# EAGLE design unihat-v1 (EAGLE 7.7.0)
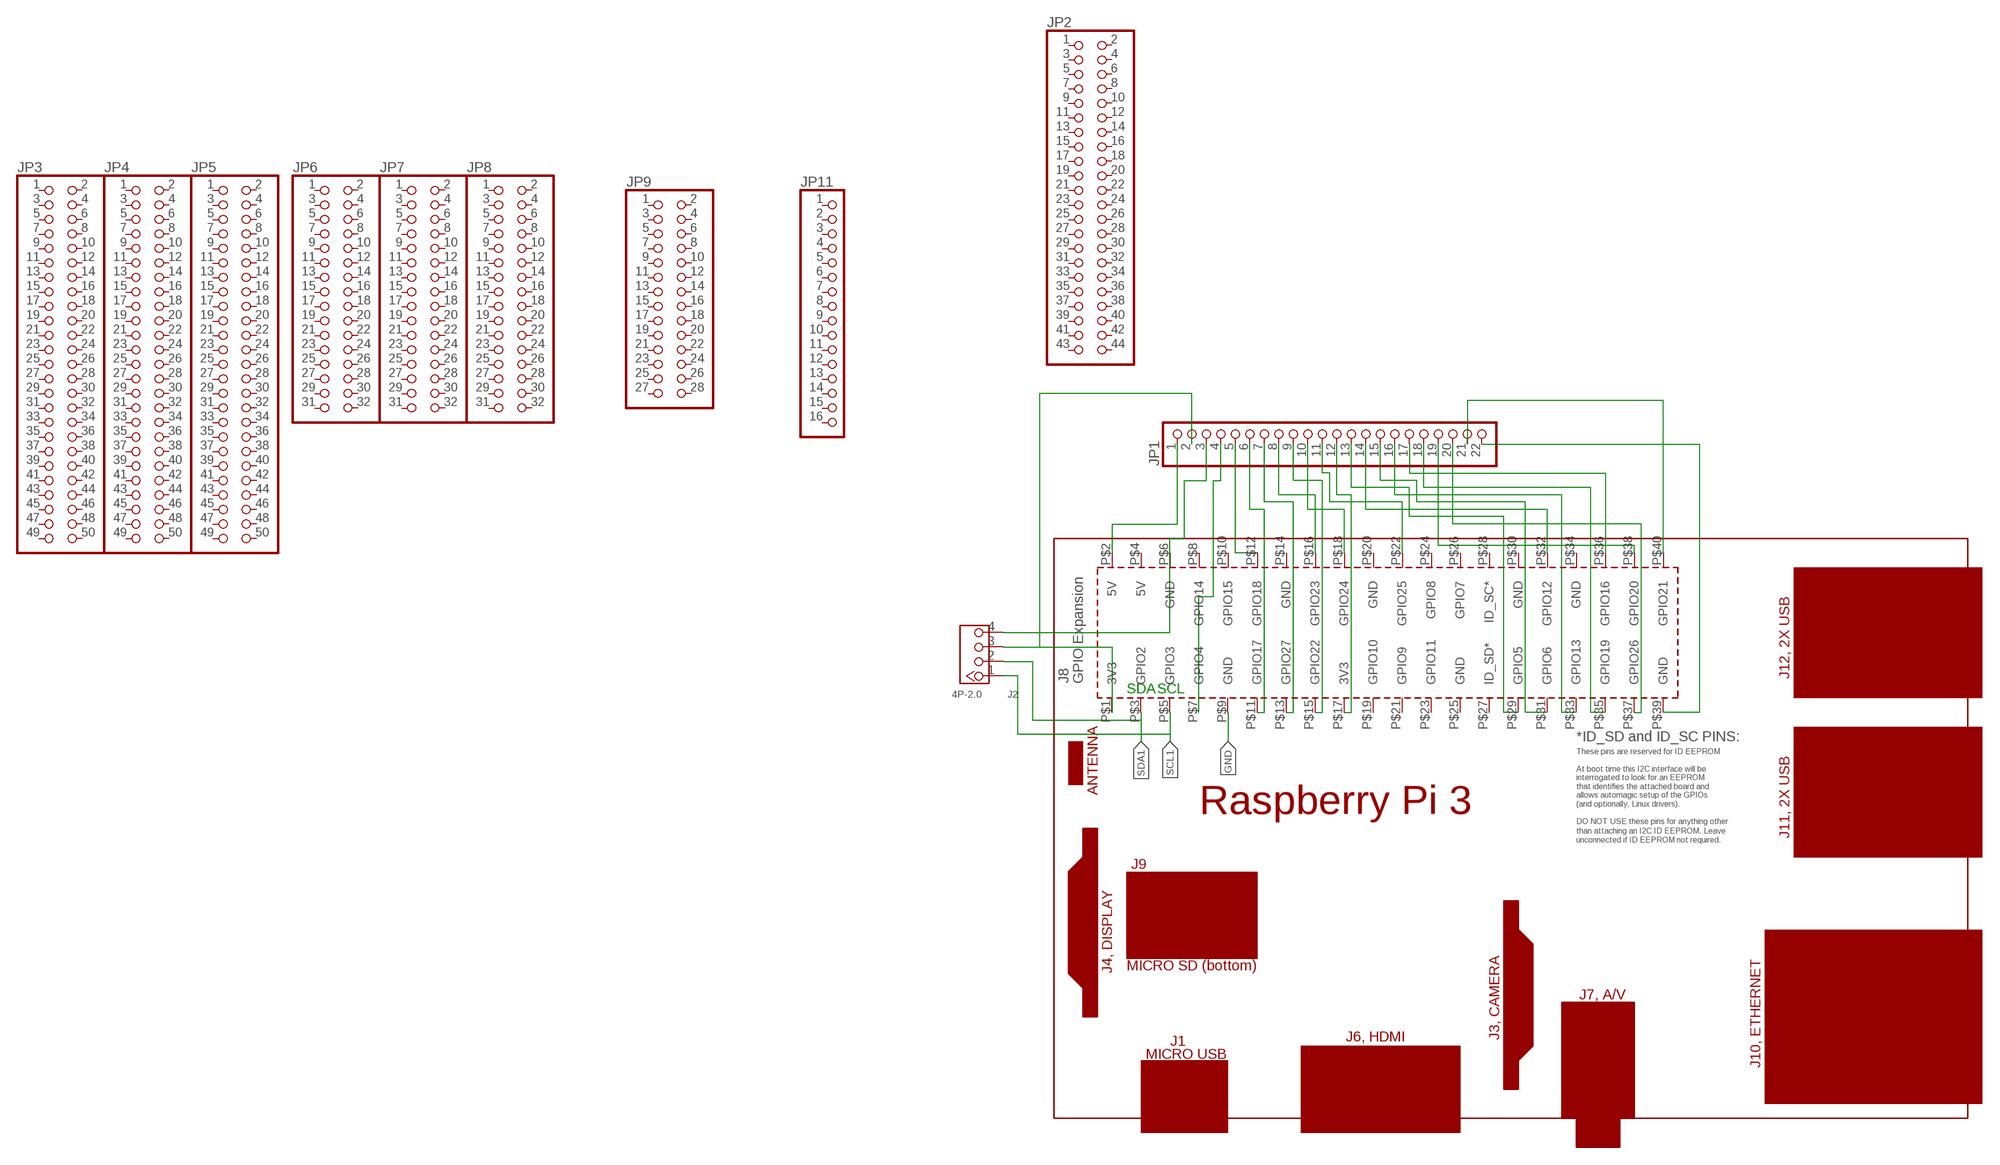
[diagram p0: schematic, sheet 1]

## Parts
J2  4P-2.0  GROVE-CONNECTOR-DIP(4P-2.0)  [HW4-2.0]
JP1  PINHD-1X22  [1X22]
JP2  PINHD-2X22  [2X22]
JP3  PINHD-2X25  [2X25]
JP4  PINHD-2X25  [2X25]
JP5  PINHD-2X25  [2X25]
JP6  PINHD-2X16  [2X16]
JP7  PINHD-2X16  [2X16]
JP8  PINHD-2X16  [2X16]
JP9  PINHD-2X14  [2X14]
JP11  PINHD-1X16  [1X16]
PCB1  RPI3  [RPI3]

## Nets
GND: PCB1.P$9(GND)
N$1: JP1.5 PCB1.P$12(GPIO18)
N$2: JP1.1 PCB1.P$2(5V)
N$3: J2.3 JP1.2 PCB1.P$1(3V3)
N$4: J2.4 JP1.3 PCB1.P$6(GND)
N$5: JP1.4 PCB1.P$7(GPIO4)
N$6: JP1.6 PCB1.P$11(GPIO17)
N$7: JP1.7 PCB1.P$13(GPIO27)
N$8: JP1.8 PCB1.P$16(GPIO23)
N$9: JP1.9 PCB1.P$15(GPIO22)
N$10: JP1.10 PCB1.P$18(GPIO24)
N$11: JP1.11 PCB1.P$22(GPIO25)
N$12: JP1.13 PCB1.P$29(GPIO5)
N$13: JP1.12 PCB1.P$17(3V3)
N$14: JP1.14 PCB1.P$32(GPIO12)
N$15: JP1.15 PCB1.P$31(GPIO6)
N$16: JP1.16 PCB1.P$33(GPIO13)
N$17: JP1.17 PCB1.P$36(GPIO16)
N$18: JP1.18 PCB1.P$35(GPIO19)
N$19: JP1.19 PCB1.P$38(GPIO20)
N$20: JP1.20 PCB1.P$37(GPIO26)
N$21: JP1.21 PCB1.P$40(GPIO21)
N$22: JP1.22 PCB1.P$39(GND)
SCL1: J2.1 PCB1.P$5(GPIO3)
SDA1: J2.2 PCB1.P$3(GPIO2)
Unconnected: JP2.1 JP2.2 JP2.3 JP2.4 JP2.5 JP2.6 JP2.7 JP2.8 JP2.9 JP2.10 JP2.11 JP2.12 JP2.13 JP2.14 JP2.15 JP2.16 JP2.17 JP2.18 JP2.19 JP2.20 JP2.21 JP2.22 JP2.23 JP2.24 JP2.25 JP2.26 JP2.27 JP2.28 JP2.29 JP2.30 JP2.31 JP2.32 JP2.33 JP2.34 JP2.35 JP2.36 JP2.37 JP2.38 JP2.39 JP2.40 JP2.41 JP2.42 JP2.43 JP2.44 JP3.1 JP3.2 JP3.3 JP3.4 JP3.5 JP3.6 JP3.7 JP3.8 JP3.9 JP3.10 JP3.11 JP3.12 JP3.13 JP3.14 JP3.15 JP3.16 JP3.17 JP3.18 JP3.19 JP3.20 JP3.21 JP3.22 JP3.23 JP3.24 JP3.25 JP3.26 JP3.27 JP3.28 JP3.29 JP3.30 JP3.31 JP3.32 JP3.33 JP3.34 JP3.35 JP3.36 JP3.37 JP3.38 JP3.39 JP3.40 JP3.41 JP3.42 JP3.43 JP3.44 JP3.45 JP3.46 JP3.47 JP3.48 JP3.49 JP3.50 JP4.1 JP4.2 JP4.3 JP4.4 JP4.5 JP4.6 JP4.7 JP4.8 JP4.9 JP4.10 JP4.11 JP4.12 JP4.13 JP4.14 JP4.15 JP4.16 JP4.17 JP4.18 JP4.19 JP4.20 JP4.21 JP4.22 JP4.23 JP4.24 JP4.25 JP4.26 JP4.27 JP4.28 JP4.29 JP4.30 JP4.31 JP4.32 JP4.33 JP4.34 JP4.35 JP4.36 JP4.37 JP4.38 JP4.39 JP4.40 JP4.41 JP4.42 JP4.43 JP4.44 JP4.45 JP4.46 JP4.47 JP4.48 JP4.49 JP4.50 JP5.1 JP5.2 JP5.3 JP5.4 JP5.5 JP5.6 JP5.7 JP5.8 JP5.9 JP5.10 JP5.11 JP5.12 JP5.13 JP5.14 JP5.15 JP5.16 JP5.17 JP5.18 JP5.19 JP5.20 JP5.21 JP5.22 JP5.23 JP5.24 JP5.25 JP5.26 JP5.27 JP5.28 JP5.29 JP5.30 JP5.31 JP5.32 JP5.33 JP5.34 JP5.35 JP5.36 JP5.37 JP5.38 JP5.39 JP5.40 JP5.41 JP5.42 JP5.43 JP5.44 JP5.45 JP5.46 JP5.47 JP5.48 JP5.49 JP5.50 JP6.1 JP6.2 JP6.3 JP6.4 JP6.5 JP6.6 JP6.7 JP6.8 JP6.9 JP6.10 JP6.11 JP6.12 JP6.13 JP6.14 JP6.15 JP6.16 JP6.17 JP6.18 JP6.19 JP6.20 JP6.21 JP6.22 JP6.23 JP6.24 JP6.25 JP6.26 JP6.27 JP6.28 JP6.29 JP6.30 JP6.31 JP6.32 JP7.1 JP7.2 JP7.3 JP7.4 JP7.5 JP7.6 JP7.7 JP7.8 JP7.9 JP7.10 JP7.11 JP7.12 JP7.13 JP7.14 JP7.15 JP7.16 JP7.17 JP7.18 JP7.19 JP7.20 JP7.21 JP7.22 JP7.23 JP7.24 JP7.25 JP7.26 JP7.27 JP7.28 JP7.29 JP7.30 JP7.31 JP7.32 JP8.1 JP8.2 JP8.3 JP8.4 JP8.5 JP8.6 JP8.7 JP8.8 JP8.9 JP8.10 JP8.11 JP8.12 JP8.13 JP8.14 JP8.15 JP8.16 JP8.17 JP8.18 JP8.19 JP8.20 JP8.21 JP8.22 JP8.23 JP8.24 JP8.25 JP8.26 JP8.27 JP8.28 JP8.29 JP8.30 JP8.31 JP8.32 JP9.1 JP9.2 JP9.3 JP9.4 JP9.5 JP9.6 JP9.7 JP9.8 JP9.9 JP9.10 JP9.11 JP9.12 JP9.13 JP9.14 JP9.15 JP9.16 JP9.17 JP9.18 JP9.19 JP9.20 JP9.21 JP9.22 JP9.23 JP9.24 JP9.25 JP9.26 JP9.27 JP9.28 JP11.1 JP11.2 JP11.3 JP11.4 JP11.5 JP11.6 JP11.7 JP11.8 JP11.9 JP11.10 JP11.11 JP11.12 JP11.13 JP11.14 JP11.15 JP11.16 PCB1.P$4(5V) PCB1.P$8(GPIO14) PCB1.P$10(GPIO15) PCB1.P$14(GND) PCB1.P$19(GPIO10) PCB1.P$20(GND) PCB1.P$21(GPIO9) PCB1.P$23(GPIO11) PCB1.P$24(GPIO8) PCB1.P$25(GND) PCB1.P$26(GPIO7) PCB1.P$27(ID_SD*) PCB1.P$28(ID_SC*) PCB1.P$30(GND) PCB1.P$34(GND)

## Notes on the sheet
- SDA | SCL

## Library data of the parts
J2 = Seeed-OPL-Connector:GROVE-CONNECTOR-DIP(4P-2.0): 320110033
JP1 = 0my2:PINHD-1X22: PIN HEADER
JP2 = 0my2:PINHD-2X22: PIN HEADER
JP3-JP5 = 0my2:PINHD-2X25: PIN HEADER
JP6-JP8 = 0my2:PINHD-2X16: PIN HEADER
JP9 = 0my2:PINHD-2X14: PIN HEADER
JP11 = 0my2:PINHD-1X16: PIN HEADER
PCB1 = 0_Rpi3_RevA:RPI3: Device for Raspberry Pi 3 board created by Dave Young for www.element14.com More information and support community is available at https://www.element14.com/community/community/raspberry-pi

## Board
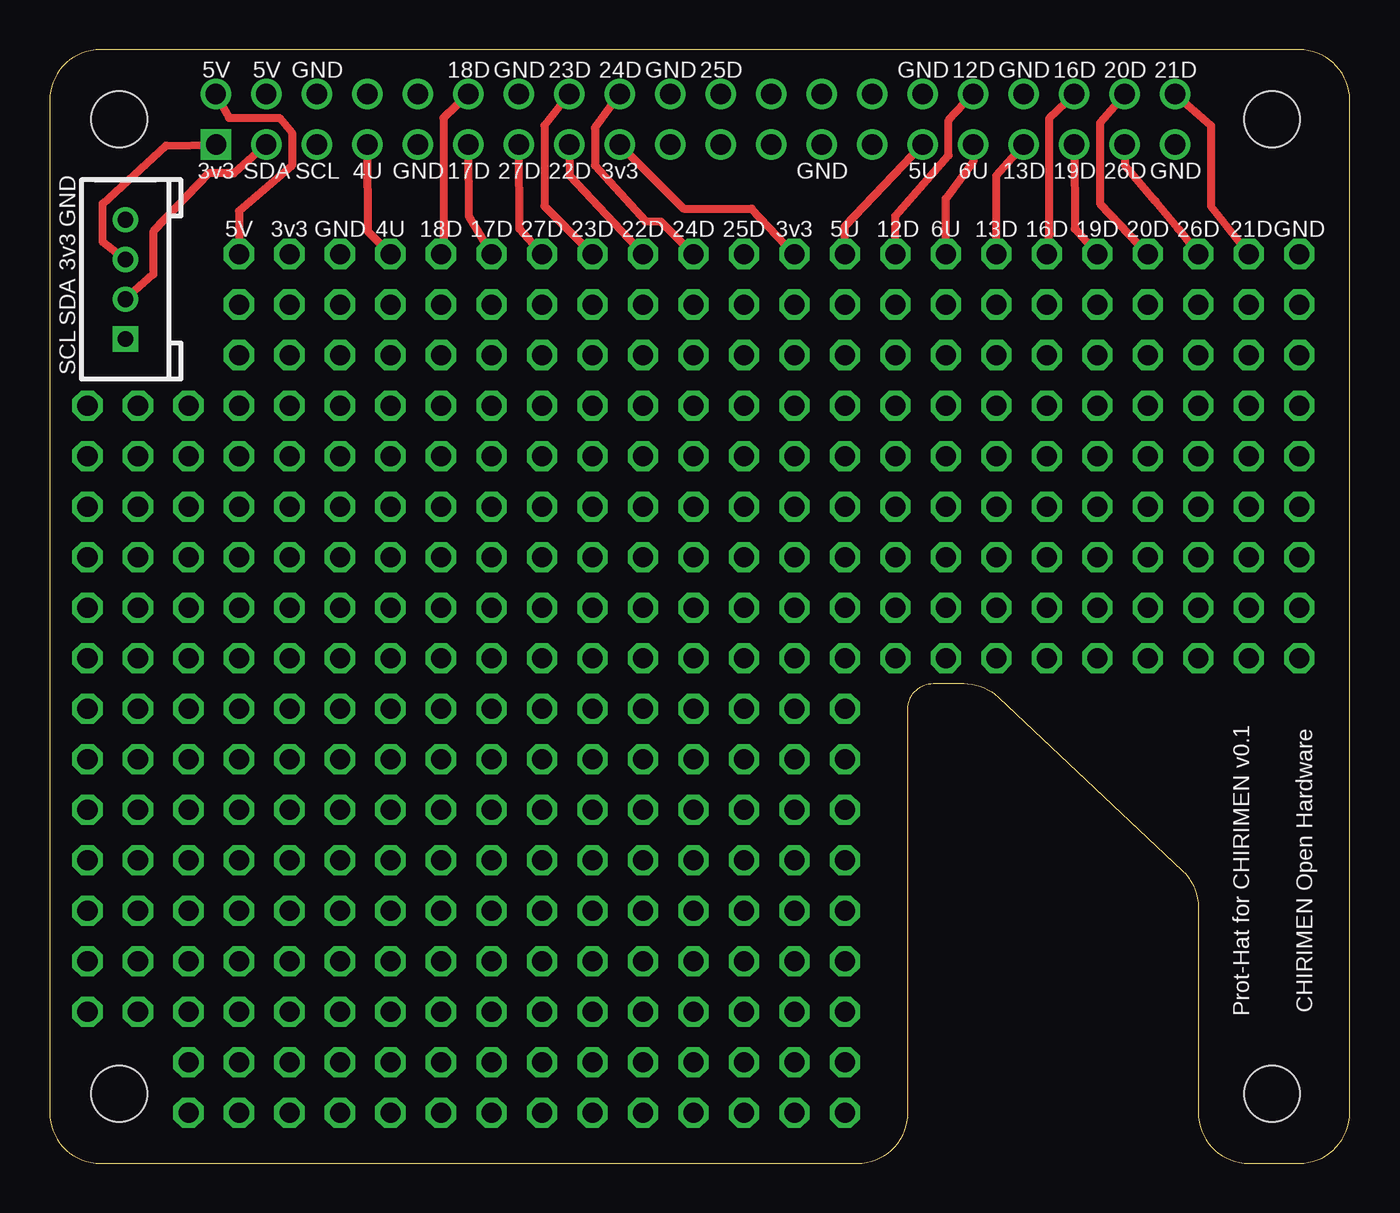
[diagram p1: board, top side]
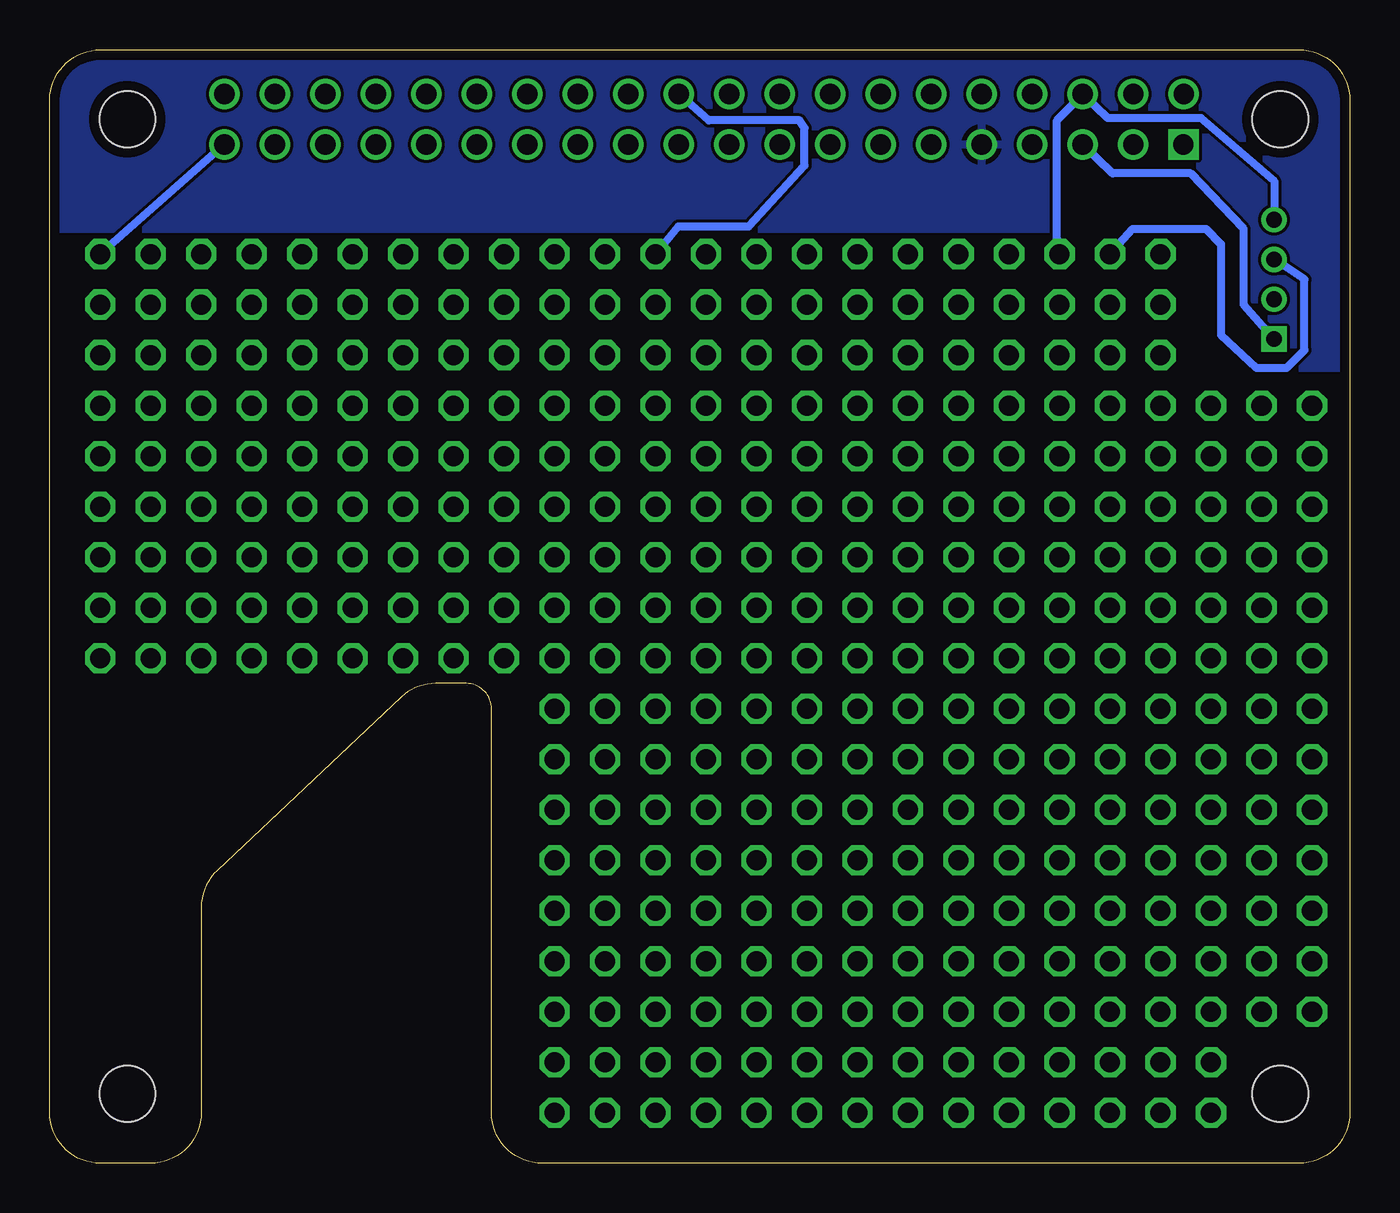
[diagram p2: board, bottom side, seen from below]

Size 65.41 x 56 mm. Coordinates in mm from the lower left corner, seen from the top.
Outline: 62.84,56 2.54,56 arc90 0,53.46 0,2.54 arc90 2.54,0 40.64,0 arc90 43.18,2.54 43.18,22.86 arc-90 44.45,24.13 45.98,24.13 arc-43 47.72,23.44 56.99,14.72 arc-47 57.78,12.87 57.78,2.54 arc90 60.33,0 62.84,0 arc90 65.41,2.54 65.41,53.47 arc90 62.84,56
Copper layers (1*16): Top 0.035mm / dielectric 1.6mm / Bottom 0.035mm
Design rules "Elecrow_2-layer_PCB_eagle_rule": minimum track width 6mil, minimum drill 12mil, track to track 6mil, track to pad 8mil, pad to pad 12mil, via to via 12mil, smd to smd 0mil, copper to edge 20mil, drill to drill 10mil, minimum pad ring 6mil, minimum via ring 6mil, stop-mask expansion 0mil, vias tented up to drill 100mil, thermal gap 10mil

### Footprints (pad centres in the part's own frame; a part is rotated, then mirrored left to right if it is on the bottom)
HW4-2.0 = drill 0.8 pad 1.27 square: 1 -3,0 | drill 0.8 pad 1.27: 2 -1,0; 3 1,0; 4 3,0
1X22 = drill 1.016 octagon: 1 -26.67,0; 2 -24.13,0; 3 -21.59,0; 4 -19.05,0; 5 -16.51,0; 6 -13.97,0; 7 -11.43,0; 8 -8.89,0; 9 -6.35,0; 10 -3.81,0; 11 -1.27,0; 12 1.27,0; 13 3.81,0; 14 6.35,0; 15 8.89,0; 16 11.43,0; 17 13.97,0; 18 16.51,0; 19 19.05,0; 20 21.59,0; 21 24.13,0; 22 26.67,0
2X22 = drill 1.016 octagon: 1 -25.4,-1.27; 2 -25.4,1.27; 3 -22.86,-1.27; 4 -22.86,1.27; 5 -20.32,-1.27; 6 -20.32,1.27; 7 -17.78,-1.27; 8 -17.78,1.27; 9 -15.24,-1.27; 10 -15.24,1.27; 11 -12.7,-1.27; 12 -12.7,1.27; 13 -10.16,-1.27; 14 -10.16,1.27; 15 -7.62,-1.27; 16 -7.62,1.27; 17 -5.08,-1.27; 18 -5.08,1.27; 19 -2.54,-1.27; 20 -2.54,1.27; 21 0,-1.27; 22 0,1.27; 23 2.54,-1.27; 24 2.54,1.27; 25 5.08,-1.27; 26 5.08,1.27; 27 7.62,-1.27; 28 7.62,1.27; 29 10.16,-1.27; 30 10.16,1.27; 31 12.7,-1.27; 32 12.7,1.27; 33 15.24,-1.27; 34 15.24,1.27; 35 17.78,-1.27; 36 17.78,1.27; 37 20.32,-1.27; 38 20.32,1.27; 39 22.86,-1.27; 40 22.86,1.27; 41 25.4,-1.27; 42 25.4,1.27; 43 27.94,-1.27; 44 27.94,1.27
2X25 = drill 1.016 octagon: 1 -30.48,-1.27; 2 -30.48,1.27; 3 -27.94,-1.27; 4 -27.94,1.27; 5 -25.4,-1.27; 6 -25.4,1.27; 7 -22.86,-1.27; 8 -22.86,1.27; 9 -20.32,-1.27; 10 -20.32,1.27; 11 -17.78,-1.27; 12 -17.78,1.27; 13 -15.24,-1.27; 14 -15.24,1.27; 15 -12.7,-1.27; 16 -12.7,1.27; 17 -10.16,-1.27; 18 -10.16,1.27; 19 -7.62,-1.27; 20 -7.62,1.27; 21 -5.08,-1.27; 22 -5.08,1.27; 23 -2.54,-1.27; 24 -2.54,1.27; 25 0,-1.27; 26 0,1.27; 27 2.54,-1.27; 28 2.54,1.27; 29 5.08,-1.27; 30 5.08,1.27; 31 7.62,-1.27; 32 7.62,1.27; 33 10.16,-1.27; 34 10.16,1.27; 35 12.7,-1.27; 36 12.7,1.27; 37 15.24,-1.27; 38 15.24,1.27; 39 17.78,-1.27; 40 17.78,1.27; 41 20.32,-1.27; 42 20.32,1.27; 43 22.86,-1.27; 44 22.86,1.27; 45 25.4,-1.27; 46 25.4,1.27; 47 27.94,-1.27; 48 27.94,1.27; 49 30.48,-1.27; 50 30.48,1.27
2X16 = drill 1.016 octagon: 1 -19.05,-1.27; 2 -19.05,1.27; 3 -16.51,-1.27; 4 -16.51,1.27; 5 -13.97,-1.27; 6 -13.97,1.27; 7 -11.43,-1.27; 8 -11.43,1.27; 9 -8.89,-1.27; 10 -8.89,1.27; 11 -6.35,-1.27; 12 -6.35,1.27; 13 -3.81,-1.27; 14 -3.81,1.27; 15 -1.27,-1.27; 16 -1.27,1.27; 17 1.27,-1.27; 18 1.27,1.27; 19 3.81,-1.27; 20 3.81,1.27; 21 6.35,-1.27; 22 6.35,1.27; 23 8.89,-1.27; 24 8.89,1.27; 25 11.43,-1.27; 26 11.43,1.27; 27 13.97,-1.27; 28 13.97,1.27; 29 16.51,-1.27; 30 16.51,1.27; 31 19.05,-1.27; 32 19.05,1.27
2X14 = drill 1.016 octagon: 1 -16.51,-1.27; 2 -16.51,1.27; 3 -13.97,-1.27; 4 -13.97,1.27; 5 -11.43,-1.27; 6 -11.43,1.27; 7 -8.89,-1.27; 8 -8.89,1.27; 9 -6.35,-1.27; 10 -6.35,1.27; 11 -3.81,-1.27; 12 -3.81,1.27; 13 -1.27,-1.27; 14 -1.27,1.27; 15 1.27,-1.27; 16 1.27,1.27; 17 3.81,-1.27; 18 3.81,1.27; 19 6.35,-1.27; 20 6.35,1.27; 21 8.89,-1.27; 22 8.89,1.27; 23 11.43,-1.27; 24 11.43,1.27; 25 13.97,-1.27; 26 13.97,1.27; 27 16.51,-1.27; 28 16.51,1.27
1X16 = drill 1.016 octagon: 1 -19.05,0; 2 -16.51,0; 3 -13.97,0; 4 -11.43,0; 5 -8.89,0; 6 -6.35,0; 7 -3.81,0; 8 -1.27,0; 9 1.27,0; 10 3.81,0; 11 6.35,0; 12 8.89,0; 13 11.43,0; 14 13.97,0; 15 16.51,0; 16 19.05,0
RPI3 = drill 1.016 square: P$1 8.37,51.23 | drill 1.016: P$2 8.357,53.772; P$3 10.897,51.232; P$4 10.897,53.772; P$5 13.437,51.232; P$6 13.437,53.772; P$7 15.977,51.232; P$8 15.977,53.772; P$9 18.517,51.232; P$10 18.517,53.772; P$11 21.057,51.232; P$12 21.057,53.772; P$13 23.597,51.232; P$14 23.597,53.772; P$15 26.137,51.232; P$16 26.137,53.772; P$17 28.677,51.232; P$18 28.677,53.772; P$19 31.217,51.232; P$20 31.217,53.772; P$21 33.757,51.232; P$22 33.757,53.772; P$23 36.297,51.232; P$24 36.297,53.772; P$25 38.837,51.232; P$26 38.837,53.772; P$27 41.377,51.232; P$28 41.377,53.772; P$29 43.917,51.232; P$30 43.917,53.772; P$31 46.457,51.232; P$32 46.457,53.772; P$33 48.997,51.232; P$34 48.997,53.772; P$35 51.537,51.232; P$36 51.537,53.772; P$37 54.077,51.232; P$38 54.077,53.772; P$39 56.617,51.232; P$40 56.617,53.772 | hole 2.8: 3.5,3.5; 61.5,3.5; 3.5,52.5; 61.5,52.5

### Placement (x,y rotation side)
J2  3.81,44.45 90 top
JP1  36.2,45.72 0 top
JP2  34.92,41.91 0 top
JP3  32.38,36.83 0 top
JP4  32.38,31.75 0 top
JP5  32.38,26.67 0 top
JP6  20.95,21.59 0 top
JP7  20.95,16.51 0 top
JP8  20.95,11.43 0 top
JP9  23.5,3.81 0 top
JP11  20.95,7.62 0 top
PCB1  0,0 0 top

### Tracks (layer width: path | path; a pad name or v marks a point on that pad's centre or on a via)
GND
  pour Bottom: -0.64,56.52 66.67,56.52 66.67,46.99 7.62,46.99 7.62,40.01 -0.64,40.01
N$1
  Top 0.406: PCB1.P$12 19.81,52.58 19.81,46.48 JP1.5
N$2
  Top 0.406: PCB1.P$2 9.02,52.58 11.56,52.58 12.19,51.82 12.19,50.16 9.53,47.88 JP1.1
N$3
  Top 0.406: J2.3 2.67,46.35 2.67,48.26 5.84,51.18 PCB1.P$1
  Bottom 0.406: JP1.2 10.92,46.99 7.24,46.99 6.48,46.23 6.48,41.66 4.7,40.01 3.17,40.01 2.29,40.89 2.29,44.45 J2.3
N$4
  Bottom 0.406: J2.4 3.81,49.4 7.49,52.58 12.19,52.58 PCB1.P$6 14.73,52.45 14.73,46.48 JP1.3
N$5
  Top 0.406: PCB1.P$7 16,46.86 JP1.4
N$6
  Top 0.406: PCB1.P$11 21.08,47.62 JP1.6
N$7
  Top 0.406: PCB1.P$13 23.62,46.99 JP1.7
N$8
  Top 0.406: PCB1.P$16 24.89,52.2 24.89,48.13 JP1.8
N$9
  Top 0.406: PCB1.P$15 26.16,49.66 JP1.9
N$10
  Top 0.406: PCB1.P$18 27.43,52.07 27.43,50.16 29.97,47.37 30.73,47.37 JP1.10
N$11
  Bottom 0.406: JP1.11 33.78,47.12 30.23,47.12 27.43,50.16 27.43,52.07 27.69,52.45 32.26,52.45 PCB1.P$22
N$12
  Top 0.406: JP1.13 40.01,47.12 PCB1.P$29
N$13
  Top 0.406: PCB1.P$17 31.88,48.01 35.31,48.01 JP1.12
N$14
  Top 0.406: JP1.14 42.55,47.62 45.21,50.67 45.21,52.45 PCB1.P$32
N$15
  Top 0.406: JP1.15 45.09,48.51 46.48,50.42 PCB1.P$31
N$16
  Top 0.406: JP1.16 47.62,49.66 PCB1.P$33
N$17
  Top 0.406: JP1.17 50.29,46.74 50.29,52.58 PCB1.P$36
N$18
  Top 0.406: PCB1.P$35 51.56,46.99 JP1.18
N$19
  Top 0.406: PCB1.P$38 52.83,52.32 52.83,48.26 JP1.19
N$20
  Top 0.406: JP1.20 56.77,46.99 55.63,48.39 54.1,50.16 PCB1.P$37
N$21
  Top 0.406: PCB1.P$40 58.42,52.2 58.42,48.13 JP1.21
N$22
  Bottom 0.406: PCB1.P$39 JP1.22
SCL1
  Bottom 0.406: J2.1 5.33,43.18 5.33,46.99 8,49.78 11.94,49.78 PCB1.P$5
SDA1
  Top 0.406: PCB1.P$3 9.27,49.78 8,49.78 5.21,46.86 5.21,44.7 J2.2

### Text on the board
tNames: 5V | 5V | GND | 18D | GND | 23D | 24D | GND | 25D | GND | 12D | GND | 16D | 20D | 21D | 3v3 | SDA | SCL | 4U | GND | 17D | 27D | 22D | 3v3 | GND | 5U | 6U | 13D | 19D | 26D | GND | GND | 5V | 3v3 | GND | 4U | 18D | 17D | 27D | 23D | 22D | 24D | 25D | 3v3 | 5U | 12D | 6U | 13D | 16D | 19D | 20D | 26D | 21D | GND | 3v3 | SDA | SCL | Prot-Hat for CHIRIMEN v0.1 | CHIRIMEN Open Hardware